# Altium schematic sheet printerRoom.SchDoc
size A4
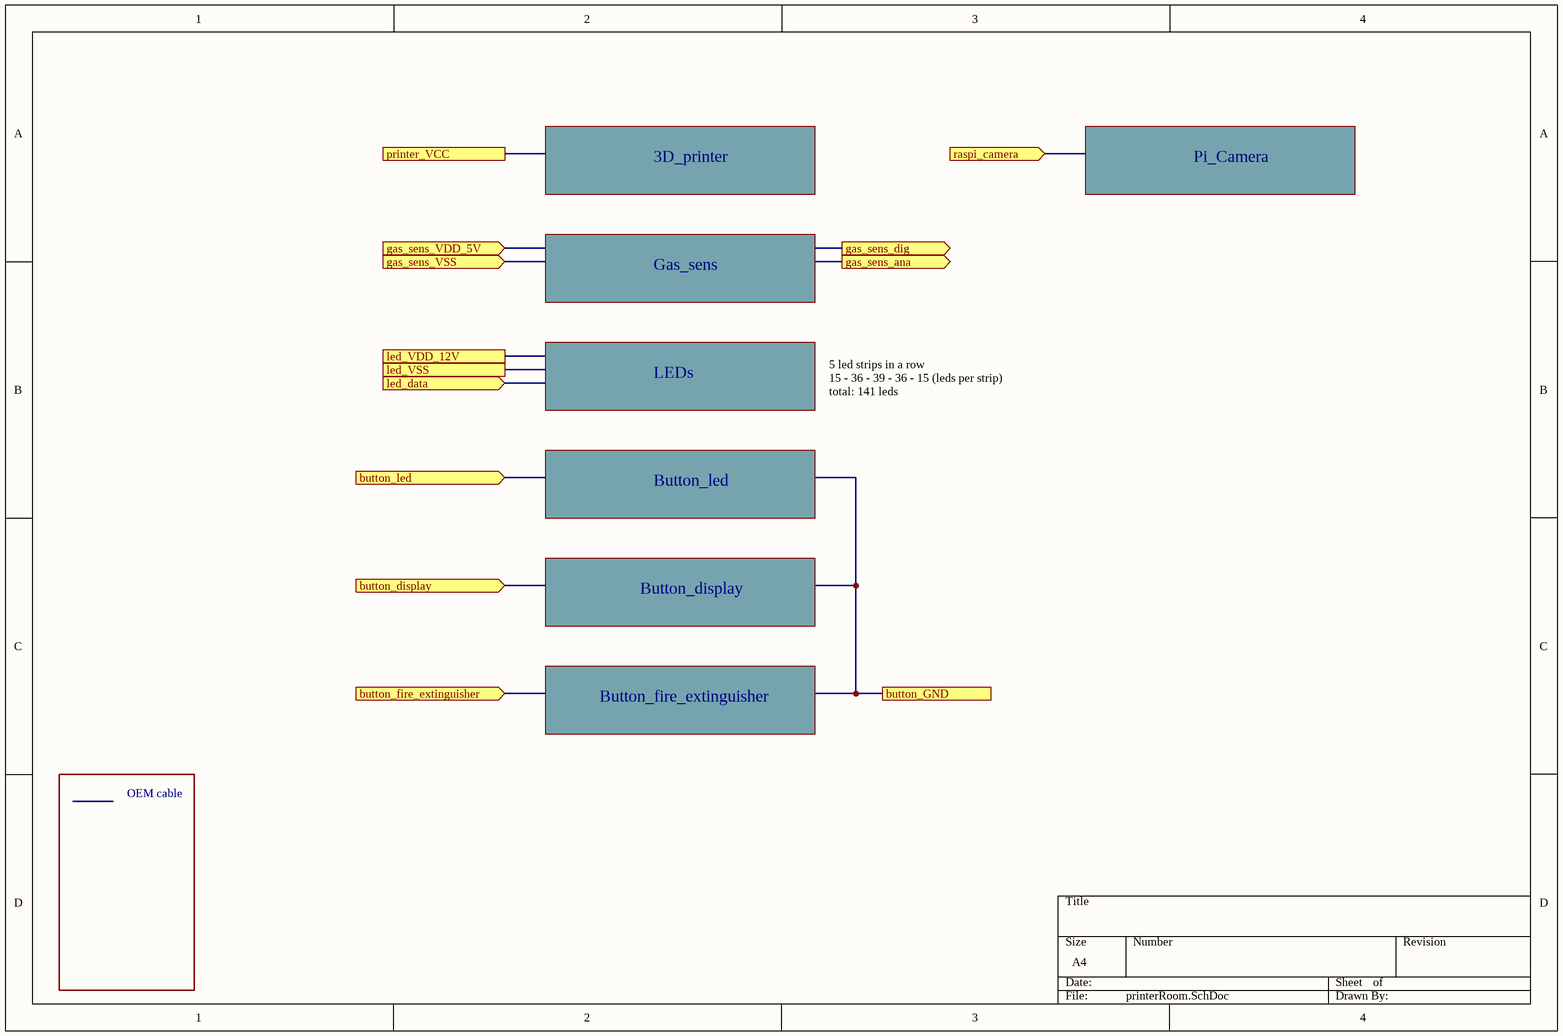
[diagram p0: printerRoom.SchDoc]

## Ports
button_display (in), button_fire_extinguisher (in), button_GND, button_led (in), gas_sens_ana (out), gas_sens_dig (out), gas_sens_VDD_5V (in), gas_sens_VSS (in), led_data (in), led_VDD_12V, led_VSS, printer_VCC, raspi_camera (in)

## Notes on the sheet
- 3D_printer
- Pi_Camera
- Gas_sens
- LEDs
- 5 led strips in a row
  15 - 36 - 39 - 36 - 15 (leds per strip)
  total: 141 leds
- Button_led
- Button_display
- Button_fire_extinguisher
- OEM cable